# EAGLE design powerboard (EAGLE 9.6.2)
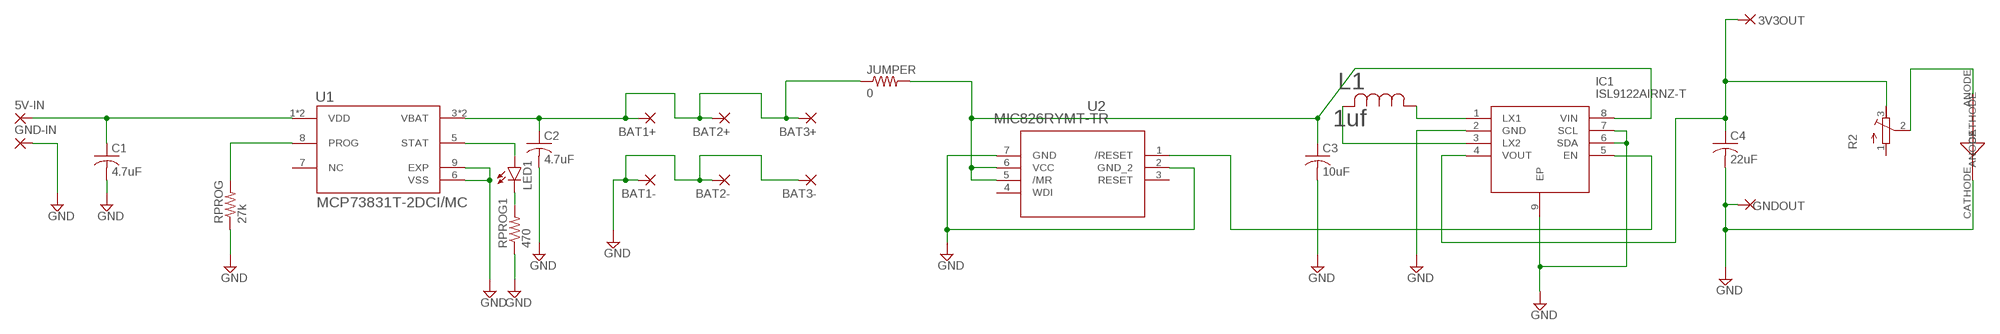
[diagram p0: schematic, sheet 1]

## Parts
3V3OUT  2,54/0,9  [2,54/0,9]
5V-IN  2,54/0,9  [2,54/0,9]
BAT1+  2,54/0,9  [2,54/0,9]
BAT1-  2,54/0,9  [2,54/0,9]
BAT2+  2,54/0,9  [2,54/0,9]
BAT2-  2,54/0,9  [2,54/0,9]
BAT3+  2,54/0,9  [2,54/0,9]
BAT3-  2,54/0,9  [2,54/0,9]
C1  4.7uF  C-USC0603K  [C0603K]
C2  4.7uF  C-USC0603K  [C0603K]
C3  10uF  C-USC0603K  [C0603K]
C4  22uF  C-USC0603K  [C0603K]
GND-IN  2,54/0,9  [2,54/0,9]
GNDOUT  2,54/0,9  [2,54/0,9]
IC1  ISL9122AIRNZ-T  [SON50P300X200X100-9N]
JUMPER  0  R-US_R0805  [R0805]
L1  1uf  IHHP0806ZHER1R0M01  [IND_IHHP-0806ZH-01_VIS]
LED1  LEDCHIPLED_0603  [CHIPLED_0603]
R2  R-TRIMM3165W  [RTRIM3165W]
RPROG  27k  R-US_R0402  [R0402]
RPROG1  470  R-US_R0402  [R0402]
U1  MCP73831T-2DCI/MC  [SON50P200X300X100-9N]
U2  MIC826RYMT-TR  [UDFN6_HKA_MCH]
U$1  CHIPLED  [CHIPLED2828]

## Nets
3.3REGULATED [power]: 3V3OUT.1(P) C4.1 IC1.4(VOUT) R2.3(E)
5VIN [power]: 5V-IN.1(P) C1.1 U1.1(VDD) U1.2(VDD)
BAT_IN [power]: C3.1 IC1.8(VIN) JUMPER.2 U2.5(/MR) U2.6(VCC)
GND [power]: BAT1-.1(P) BAT2-.1(P) BAT3-.1(P) C1.2 C2.2 C3.2 C4.2 GND-IN.1(P) GNDOUT.1(P) IC1.2(GND) IC1.6(SDA) IC1.7(SCL) IC1.9(EP) RPROG1.1 RPROG.1 U1.6(VSS) U1.9(EXP) U2.2(GND_2) U2.7(GND) U$1.CATHODE
INDUCTOR1: IC1.3(LX2) L1.2
INDUCTOR2: IC1.1(LX1) L1.1
JUMPER [power]: BAT1+.1(P) BAT2+.1(P) BAT3+.1(P) C2.1 JUMPER.1 U1.3(VBAT) U1.4(VBAT)
LED+ [power]: R2.2(S) U$1.ANODE
N$1: RPROG.2 U1.8(PROG)
N$4: LED1.A U1.5(STAT)
N$5: LED1.C RPROG1.2
N$10: IC1.5(EN) U2.1(/RESET)
Unconnected: R2.1(A) U1.7(NC) U2.3(RESET) U2.4(WDI)

## Library data of the parts
3V3OUT 5V-IN BAT1+ BAT1- BAT2+ BAT2- BAT3+ BAT3- GND-IN GNDOUT = wirepad:2,54/0,9: THROUGH-HOLE PAD
C1-C4 = rcl:C-US: CAPACITOR, American symbol; SPICEPREFIX: C
IC1 = ISL9122AIRNZ-T:ISL9122AIRNZ-T: ULTRA-LOW IQ BUCK-BOOST REGULATO Source: Datasheet <https://www.renesas.com/jp/ja/www/doc/datasheet/isl9122a.pdf>; DESCRIPTION: ULTRA-LOW IQ BUCK-BOOST REGULATO; HEIGHT: 1mm; MANUFACTURER_NAME: Renesas Electronics; MANUFACTURER_PART_NUMBER: ISL9122AIRNZ-T; MOUSER_PART_NUMBER: 968-ISL9122AIRNZ-T; MOUSER_PRICE-STOCK: https://www.mouser.co.uk/ProductDetail/Renesas-Intersil/ISL9122AIRNZ-T?qs=sPbYRqrBIVkRyMlACiSIsQ%3D%3D
JUMPER RPROG RPROG1 = rcl:R-US_: RESISTOR, American symbol; SPICEPREFIX: R
L1 = vishayinductor:IHHP0806ZHER1R0M01; COPYRIGHT: Copyright (C) 2023 Ultra Librarian. All rights reserved.; DIGI-KEY_PART_NUMBER_1: 541-IHHP0806ZHER1R0M01TR-ND; DIGI-KEY_PART_NUMBER_2: 541-IHHP0806ZHER1R0M01CT-ND; DIGI-KEY_PART_NUMBER_3: 541-IHHP0806ZHER1R0M01DKR-ND; MANUFACTURER_PART_NUMBER: IHHP0806ZHER1R0M01; MFR_NAME: Vishay
LED1 = led:LED: LED OSRAM: - CHIPLED LG R971, LG N971, LY N971, LG Q971, LY Q971, LO R971, LY R971 LH N974, LH R974 LS Q976, LO Q976, LY Q976 LO Q996 - Hyper CHIPLED LW Q18S LB Q993, LB Q99A, LB R99A - SideLED LS A670, LO A670, LY A670, LG A670, LP A670 LB A673, LV A673, LT A673, LW A673 LH A674 LY A675 LS A676, LA A676, LO A676, LY A676, LW A676 LS A679, LY A679, LG A679 - Hyper Micro SIDELED® LS Y876, LA Y876, LO Y876, LY Y876 LT Y87S - SmartLED LW L88C, LW L88S LB L89C, LB L89S, LG L890 LS L89K, LO L89K, LY L89K LS L896, LA L896, LO L896, LY L896 - TOPLED LS T670, LO T670, LY T670, LG T670, LP T670 LSG T670, LSP T670, LSY T670, LOP T670, LYG T670 LG T671, LOG T671, LSG T671 LB T673, LV T673, LT T673, LW T673 LH T674 LS T676, LA T676, LO T676, LY T676, LB T676, LH T676, LSB T676, LW T676 LB T67C, LV T67C, LT T67C, LS T67K, LO T67K, LY T67K, LW E67C LS E67B, LA E67B, LO E67B, LY E67B, LB E67C, LV E67C, LT E67C LW T67C LS T679, LY T679, LG T679 LS T770, LO T770, LY T770, LG T770, LP T770 LB T773, LV T773, LT T773, LW T773 LH T774 LS E675, LA E675, LY E675, LS T675 LS T776, LA T776, LO T776, LY T776, LB T776 LHGB T686 LT T68C, LB T68C - Hyper Mini TOPLED® LB M676 - Mini TOPLED Santana® LG M470 LS M47K, LO M47K, LY M47K Source: http://www.osram.convergy.de LUXEON: - LUMILED® LXK2-PW12-R00, LXK2-PW12-S00, LXK2-PW14-U00, LXK2-PW14-V00 LXK2-PM12-R00, LXK2-PM12-S00, LXK2-PM14-U00 LXK2-PE12-Q00, LXK2-PE12-R00, LXK2-PE12-S00, LXK2-PE14-T00, LXK2-PE14-U00 LXK2-PB12-K00, LXK2-PB12-L00, LXK2-PB12-M00, LXK2-PB14-N00, LXK2-PB14-P00, LXK2-PB14-Q00 LXK2-PR12-L00, LXK2-PR12-M00, LXK2-PR14-Q00, LXK2-PR14-R00 LXK2-PD12-Q00, LXK2-PD12-R00, LXK2-PD12-S00 LXK2-PH12-R00, LXK2-PH12-S00 LXK2-PL12-P00, LXK2-PL12-Q00, LXK2-PL12-R00 Source: www.luxeon.com KINGBRIGHT: KA-3528ASYC Source: www.kingbright.com
R2 = rcl:R-TRIMM: Trimm resistor; SPICEMODEL: X; SPICEPREFIXL: POT
U1 = MCP73831T-2DCI_MC:MCP73831T-2DCI/MC: Check availability <https://pricing.snapeda.com/parts/MCP73831T-2DCI/MC/Microchip/view-part?ref=eda>; AVAILABILITY: In Stock; DESCRIPTION: Tiny Integrated Li-Ion/Li-Poly Charge mgnt controller, 4.2V Vreg out; MF: Microchip; MP: MCP73831T-2DCI/MC; PACKAGE: VFDFN-8 Microchip; PRICE: None; PURCHASE-URL: https://pricing.snapeda.com/search/part/MCP73831T-2DCI/MC/?ref=eda
U2 = mic826rymt-tr:MIC826RYMT-TR; COPYRIGHT: Copyright (C) 2023 Ultra Librarian. All rights reserved.; DIGI-KEY_PART_NUMBER_1: 576-4360-1-ND; DIGI-KEY_PART_NUMBER_2: 576-4360-2-ND; DIGI-KEY_PART_NUMBER_3: 576-4360-6-ND; MANUFACTURER_PART_NUMBER: MIC826RYMT-TR; MFR_NAME: Microchip
U$1 = samsung_chipled:CHIPLED

## Net classes
1 power: width 0.381 mm

## Board
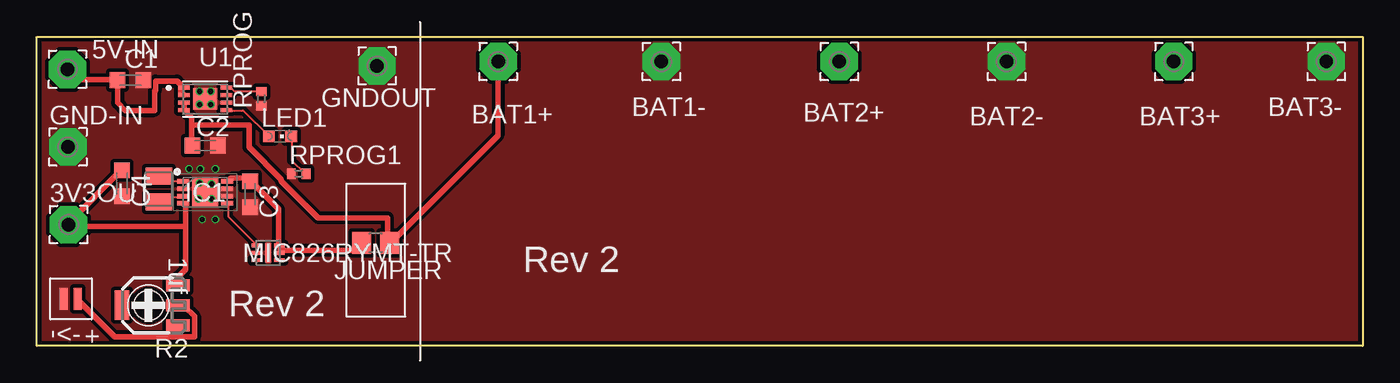
[diagram p1: board, top side]
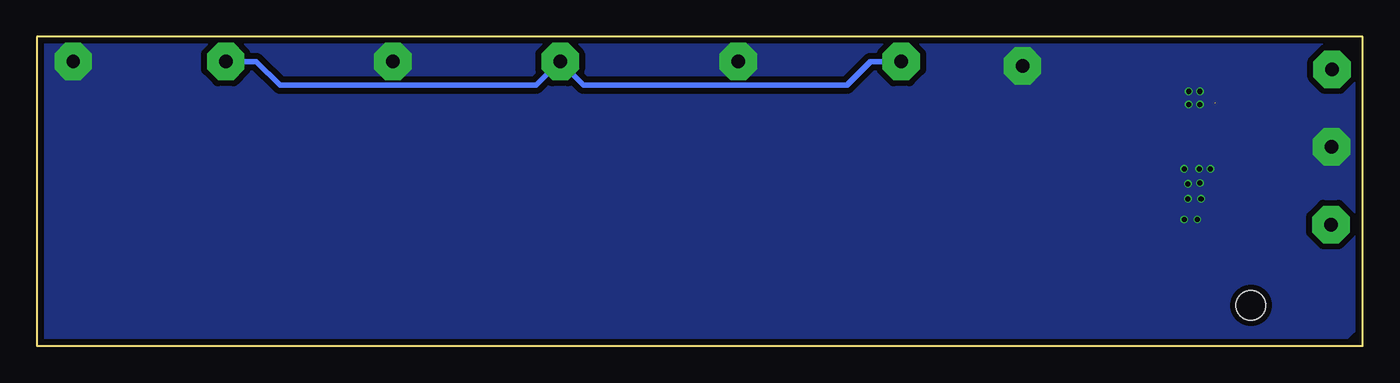
[diagram p2: board, bottom side, seen from below]

Size 90 x 21 mm. Coordinates in mm from the lower left corner, seen from the top.
Outline: 0,0 0,21 90,21 90,0 0,0
Copper layers (1*16): Top 0.035mm / dielectric 1.6mm / Bottom 0.035mm
Design rules "jlcpcb-2layers": minimum track width 5mil, minimum drill 0.3mm, track to track 5mil, track to pad 5mil, pad to pad 5mil, via to via 5mil, smd to smd 5mil, copper to edge 0.2mm, drill to drill 6mil, minimum pad ring 10mil, minimum via ring 3mil, stop-mask expansion 4mil, vias tented up to drill 0mil, thermal gap 10mil

### Footprints (pad centres in the part's own frame; a part is rotated, then mirrored left to right if it is on the bottom)
2,54/0,9 = drill 0.914 pad 2.54 octagon: 1 0,0
C0603K = smd 1.05 x 1.08: 1 -0.875,0; 2 0.875,0
SON50P300X200X100-9N = smd 0.8 x 0.3: 1 -1.5,0.75; 2 -1.5,0.25; 3 -1.5,-0.25; 4 -1.5,-0.75; 5 1.5,-0.75; 6 1.5,-0.25; 7 1.5,0.25; 8 1.5,0.75 | smd 1.75 x 1.9: 9 0,0
R0805 = smd 1.3 x 1.5: 1 -0.95,0; 2 0.95,0
IND_IHHP-0806ZH-01_VIS = smd 1.156 x 1.803: 1 -0.883,0; 2 0.883,0
CHIPLED_0603 = smd 0.8 x 0.8: A 0,-0.75; C 0,0.75
RTRIM3165W = smd 0.8 x 1.6: 1 -1.35,-2; 2 0,-2; 3 1.35,-2 | smd 2 x 1: 4 0,1.8 | hole 2: 0,0
R0402 = smd 0.6 x 0.7: 1 -0.5,0; 2 0.5,0
SON50P200X300X100-9N = smd 0.84 x 0.27: 1 -1.435,0.75; 2 -1.435,0.25; 3 -1.435,-0.25; 4 -1.435,-0.75; 5 1.435,-0.75; 6 1.435,-0.25; 7 1.435,0.25; 8 1.435,0.75 | smd 1.63 x 1.43: 9 0,0
UDFN6_HKA_MCH = smd 0.711 x 0.254: 1 -0.749,0.5; 2 -0.749,0; 3 -0.749,-0.5; 4 0.749,-0.5; 5 0.749,0; 6 0.749,0.5 | smd 0.381 x 1.321: 7 0,0
CHIPLED2828 = smd 1.5 x 0.56: ANODE 0,0.46; CATHODE 0,-0.5

### Placement (x,y rotation side)
3V3OUT  2.16,8.24 0 top
5V-IN  2.08,18.8 0 top
BAT1+  31.32,19.32 0 top
BAT1-  42.4,19.32 0 top
BAT2+  54.48,19.32 0 top
BAT2-  65.83,19.32 0 top
BAT3+  77.18,19.32 0 top
BAT3-  87.53,19.32 0 top
C1  6.35,18.05 0 top
C2  11.43,13.61 0 top
C3  14.48,10.3 270 top
C4  5.78,11.05 270 top
GND-IN  2.11,13.51 0 top
GNDOUT  23.1,19.02 0 top
IC1  11.43,10.43 0 top
JUMPER  23,7 180 top
L1  8.29,10.65 270 top
LED1  16.51,14.24 270 top
R2  7.58,2.75 90 top
RPROG  15.24,16.78 90 top
RPROG1  17.78,11.7 0 top
U1  11.43,16.78 0 top
U2  15.7,6.32 0 top
U$1  2.32,3.19 270 top

### Tracks (layer width: path | path; a pad name or v marks a point on that pad's centre or on a via)
3.3REGULATED
  Top 0.381: 10.1,8.1 10.1,5.2 9.6,4.7 9.6,4.2 R2.3 | 10.1,8.1 10.1,9.5 10,9.6 IC1.4 | C4.1 5.7,11.9 2.2,8.4 2.2,8.3 3V3OUT.1 2.2,8.1 10.1,8.1
5VIN
  Top 0.381: 5V-IN.1 2.1,18.7 2.1,18.1 5.4,18.1 C1.1 5.47,16.52 6,16 8,16 8,17.31 8.07,17.38 8.07,18 9.53,18 9.76,17.76 | 9.76,17.76 U1.1 | U1.2 9.76,17.26 9.76,17.76
BAT_IN
  Top 0.381: IC1.8 13,11.2 13.2,11.4 14.4,11.4 14.4,11.2 C3.1 14.6,11.1 16.4,9.3 16.4,7 U2.6 16.5,6.8 16.5,6.5 | 16.5,6.5 16.5,6.4 U2.5 | 16.5,6.5 22,6.5 22,7 JUMPER.2
GND  (via drill 0.35)
  other vias: 11.05,11.06 10.34,12.02 11.1,12.02 12.11,12.02 11.22,8.59 12.11,8.59 11.86,9.99 10.97,9.99 11.86,11 11.05,17.29 11.81,17.29 11.05,16.4 11.81,16.4
  pour Bottom (isolate 0.406, no thermals): 0,21.21 90.5,21.21 90.5,0.27 1.27,0.27 0,1.54
  pour Top (isolate 0.254, no thermals): 0,0.27 0,21.21 90.5,21.21 90.5,0.27
INDUCTOR1
  Top 0.127: IC1.3 9.9,10.1 8.3,10.1 8.3,9.8 L1.2
INDUCTOR2
  Top 0.127: IC1.1 9.9,11.2 8.3,11.2 8.3,11.5 L1.1
JUMPER  (1 unrouted)
  Top 0.381: 10,16.5 10,16.1 U1.4 10.1,15.9 10.5,15.5 10.5,15 | 10.5,15 10.5,13.7 C2.1 | BAT1+.1 31.3,19.3 31.3,14.3 24,7 JUMPER.1 23.8,7.1 23.8,8.7 19.1,8.7 16.6,11.2 16.6,11.3 14.4,13.5 14.4,15 10.5,15
  Bottom 0.381: BAT3+.1 77.1,19.3 75.1,19.3 73.5,17.7 56.1,17.7 BAT2+.1 54.4,19.2 52.9,17.7 35,17.7 33.4,19.3 31.4,19.3 BAT1+.1
LED+
  Top 0.381: U$1.ANODE 2.8,3.1 5.3,0.6 10.7,0.6 10.7,2 10,2.7 9.6,2.7 R2.2
N$1
  Top 0.127: RPROG.2 15.2,17.3 13.4,17.3 13.2,17.5 12.9,17.5 U1.8
N$4
  Top 0.127: LED1.A 14,16 12.9,16 U1.5
N$5
  Top 0.127: RPROG1.2 18.2,11.7 17.3,12.6 17.3,14.2 LED1.C
N$10
  Top 0.127: U2.1 14.9,6.9 13,8.8 13,9.6 IC1.5

### Text on the board
tNames: Rev 2 | Rev 2